# Altium schematic sheet 04.PowerSupply.SchDoc: PowerSupply
size A3; DrawnBy: My My; SheetNumber: 4; SheetTotal: 4
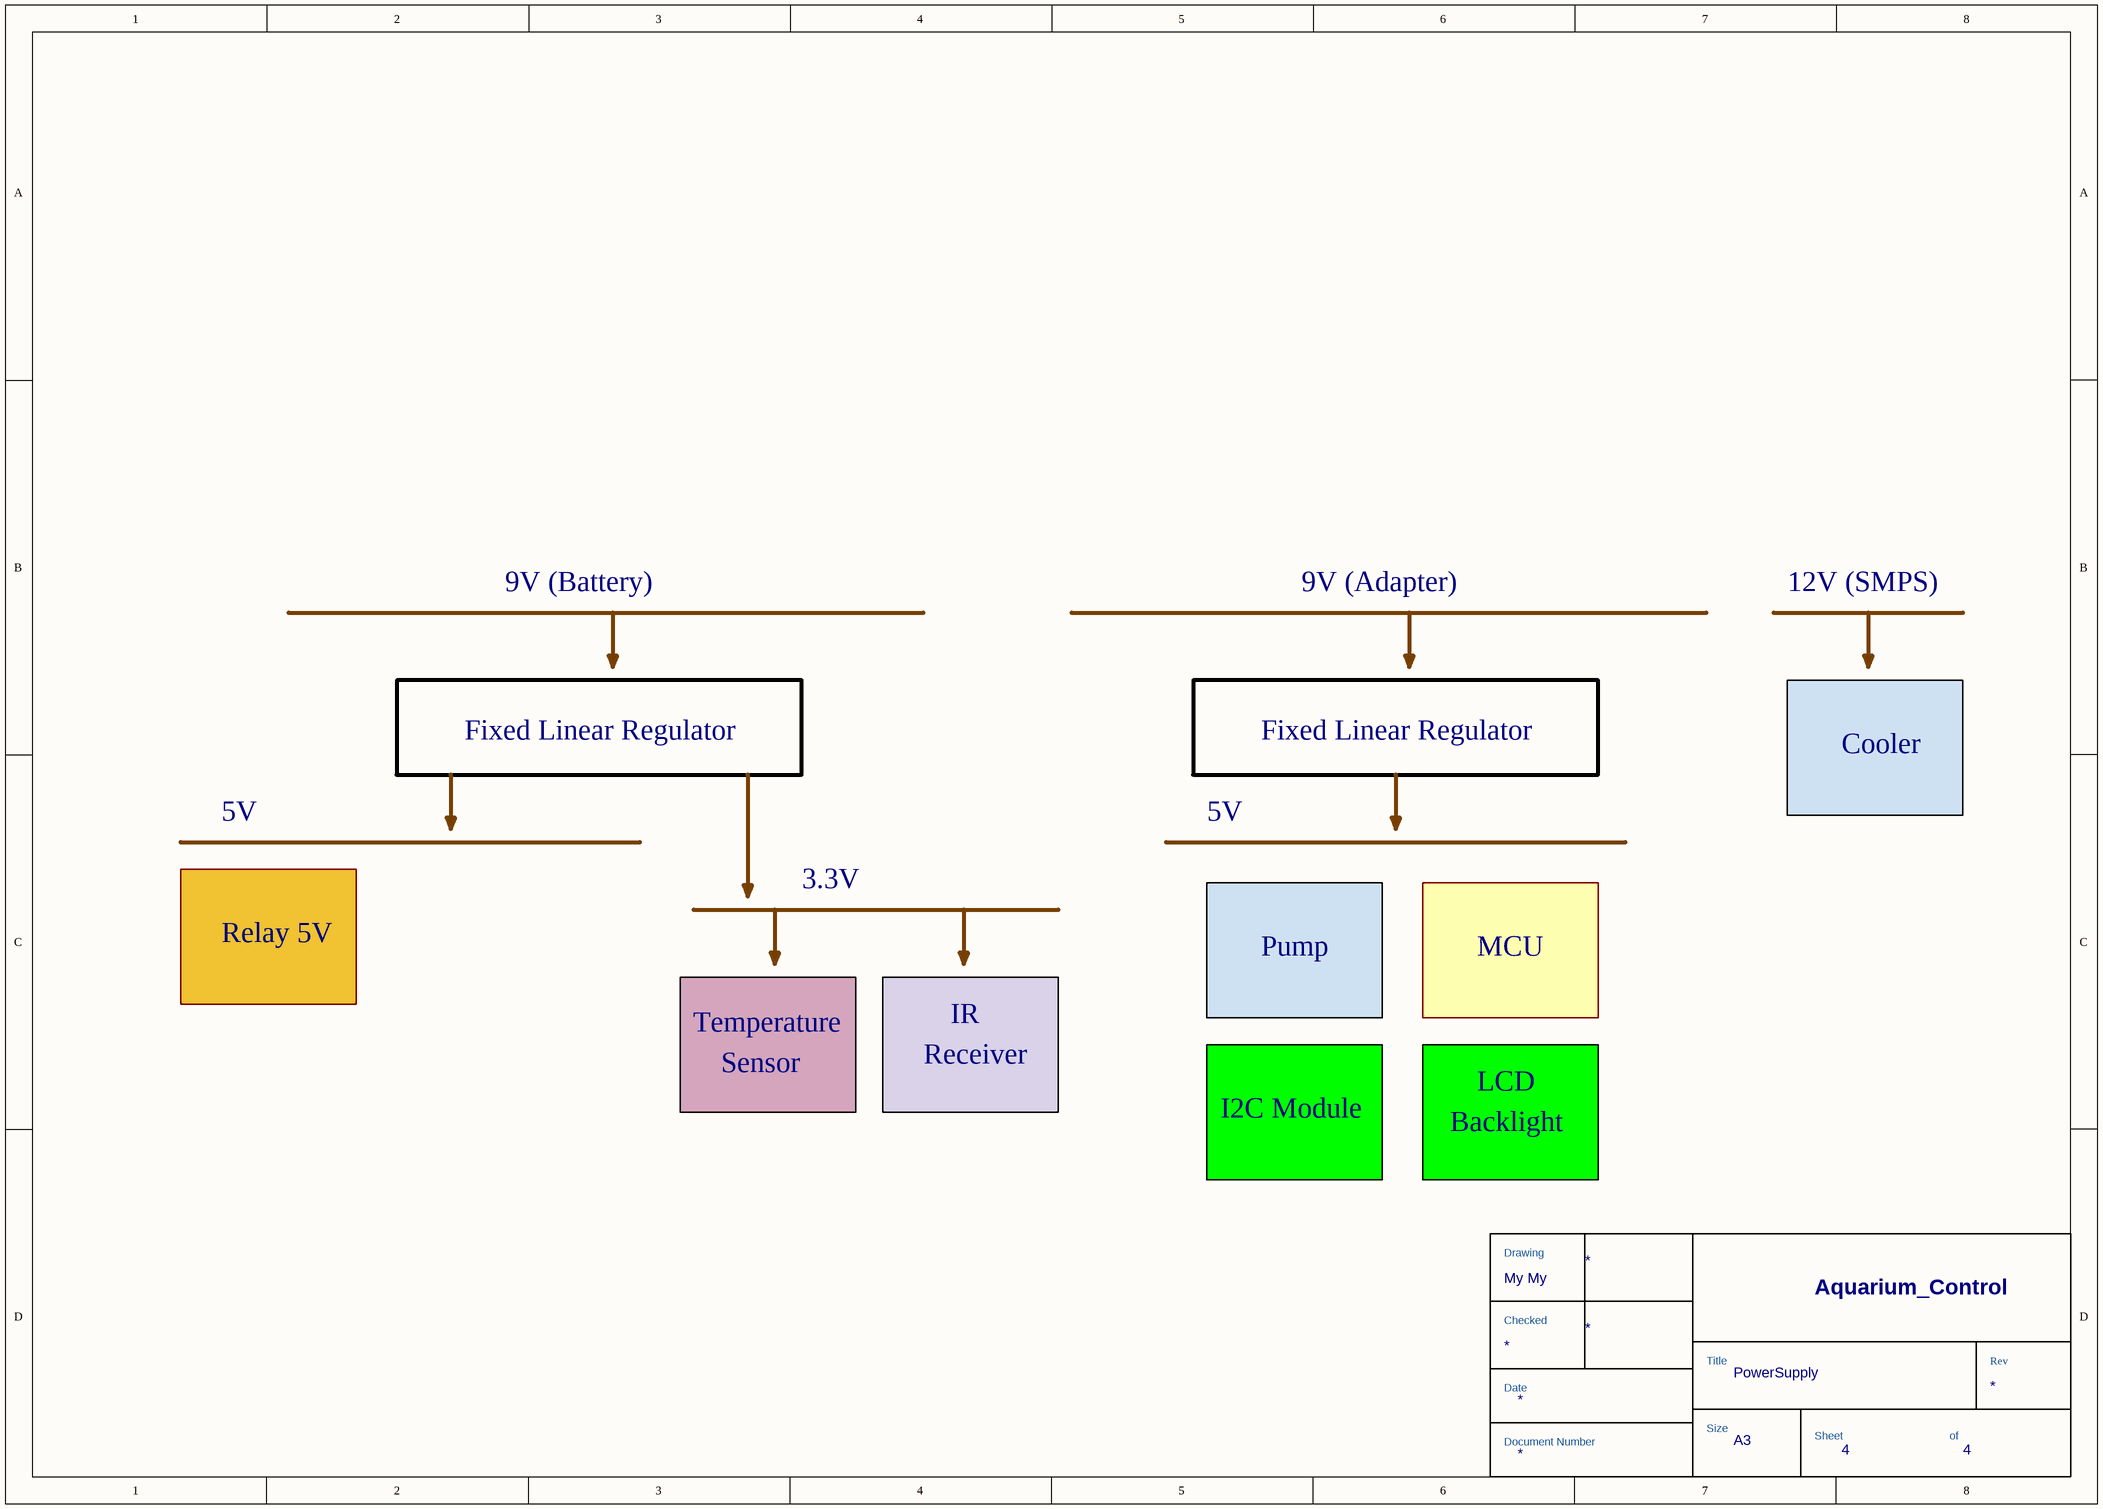
[diagram p0: 04.PowerSupply.SchDoc]

## Parts
*  TitleBlock  (value not drawn)  (graphical)

## Notes on the sheet
- 9V (Battery)
- 9V (Adapter)
- 12V (SMPS)
- Fixed Linear Regulator
- Cooler
- 5V
- 3.3V
- Relay 5V
- Pump
- MCU
- Sensor
- Temperature
- IR
- Receiver
- I2C Module
- LCD
- Backlight
- (in symbol TitleBlock) Drawing; Aquarium_Control; Checked; Title; Rev; Date; Size; Sheet; of; Document Number; A3

## Library data of the parts
* = TitleBlock: Common Title Block